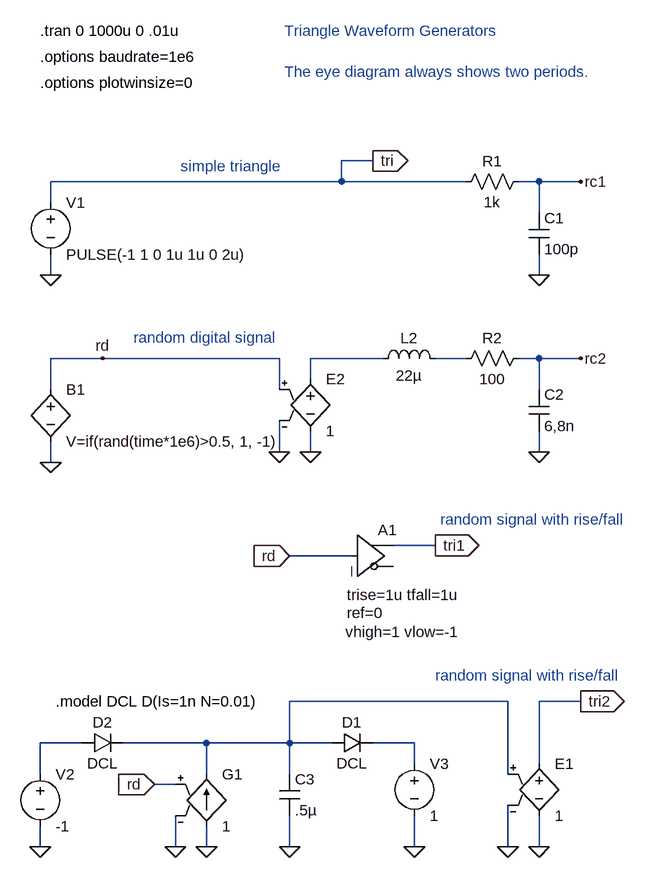
[diagram p0: schematic triangle_eye_diagram.asc]
triangle_eye_diagram.asc, the LTspice schematic file:
Version 4
SHEET 1 880 1220
WIRE -64 144 -112 144
WIRE -112 176 -112 144
WIRE -112 176 -560 176
WIRE 80 176 -112 176
WIRE 192 176 160 176
WIRE 256 176 192 176
WIRE -560 208 -560 176
WIRE 192 224 192 176
WIRE -560 320 -560 288
WIRE 192 320 192 288
WIRE -480 448 -560 448
WIRE -208 448 -480 448
WIRE -48 448 -160 448
WIRE 80 448 32 448
WIRE 192 448 160 448
WIRE 256 448 192 448
WIRE -160 480 -160 448
WIRE -560 496 -560 448
WIRE -208 496 -208 448
WIRE 192 496 192 448
WIRE -208 592 -208 544
WIRE -160 592 -160 560
WIRE 192 592 192 560
WIRE -560 608 -560 576
WIRE 32 736 -32 736
WIRE -96 752 -192 752
WIRE 144 976 -192 976
WIRE 256 976 192 976
WIRE -512 1040 -576 1040
WIRE -320 1040 -448 1040
WIRE -192 1040 -192 976
WIRE -192 1040 -320 1040
WIRE -128 1040 -192 1040
WIRE 0 1040 -64 1040
WIRE 0 1072 0 1040
WIRE 192 1072 192 976
WIRE -576 1088 -576 1040
WIRE -320 1088 -320 1040
WIRE -192 1088 -192 1040
WIRE 144 1088 144 976
WIRE -368 1104 -400 1104
WIRE -576 1200 -576 1168
WIRE -368 1200 -368 1152
WIRE -320 1200 -320 1168
WIRE -192 1200 -192 1152
WIRE 0 1200 0 1152
WIRE 144 1200 144 1136
WIRE 192 1200 192 1152
FLAG 192 320 0
FLAG -560 320 0
FLAG 256 176 rc1
FLAG -64 144 tri
IOPIN -64 144 Out
FLAG -560 608 0
FLAG 192 592 0
FLAG 256 448 rc2
FLAG -480 448 rd
FLAG 32 736 tri1
IOPIN 32 736 Out
FLAG 0 1200 0
FLAG -576 1200 0
FLAG -320 1200 0
FLAG -192 1200 0
FLAG -368 1200 0
FLAG -400 1104 rd
IOPIN -400 1104 In
FLAG 144 1200 0
FLAG 192 1200 0
FLAG 256 976 tri2
IOPIN 256 976 Out
FLAG -192 752 rd
IOPIN -192 752 In
FLAG -160 592 0
FLAG -208 592 0
SYMBOL voltage -560 192 R0
WINDOW 123 0 0 Left 0
WINDOW 39 0 0 Left 0
SYMATTR InstName V1
SYMATTR Value PULSE(-1 1 0 1u 1u 0 2u)
SYMBOL res 64 192 R270
WINDOW 0 32 56 VTop 0
WINDOW 3 0 56 VBottom 0
SYMATTR InstName R1
SYMATTR Value 1k
SYMBOL cap 176 224 R0
SYMATTR InstName C1
SYMATTR Value 100p
SYMBOL bv -560 480 R0
SYMATTR InstName B1
SYMATTR Value V=if(rand(time*1e6)>0.5, 1, -1)
SYMBOL res 64 464 R270
WINDOW 0 32 56 VTop 0
WINDOW 3 0 56 VBottom 0
SYMATTR InstName R2
SYMATTR Value 100
SYMBOL cap 176 496 R0
SYMATTR InstName C2
SYMATTR Value 6,8n
SYMBOL ind -64 464 R270
WINDOW 0 32 56 VTop 0
WINDOW 3 5 56 VBottom 0
SYMATTR InstName L2
SYMATTR Value 22µ
SYMBOL Digital\\buf -96 688 R0
WINDOW 123 -8 152 Left 0
WINDOW 39 -8 124 Left 0
WINDOW 40 -10 181 Left 0
SYMATTR InstName A1
SYMATTR Value2 ref=0
SYMATTR SpiceLine trise=1u tfall=1u
SYMATTR SpiceLine2 vhigh=1 vlow=-1
SYMBOL g -320 1072 R0
SYMATTR InstName G1
SYMATTR Value 1
SYMBOL cap -208 1088 R0
SYMATTR InstName C3
SYMATTR Value .5µ
SYMBOL diode -128 1056 R270
WINDOW 0 32 32 VTop 0
WINDOW 3 0 32 VBottom 0
SYMATTR InstName D1
SYMATTR Value DCL
SYMBOL diode -512 1056 R270
WINDOW 0 32 32 VTop 0
WINDOW 3 0 32 VBottom 0
SYMATTR InstName D2
SYMATTR Value DCL
SYMBOL voltage -576 1072 R0
SYMATTR InstName V2
SYMATTR Value -1
SYMBOL voltage 0 1056 R0
SYMATTR InstName V3
SYMATTR Value 1
SYMBOL e 192 1056 R0
SYMATTR InstName E1
SYMATTR Value 1
SYMBOL e -160 464 R0
SYMATTR InstName E2
SYMATTR Value 1
TEXT -576 -16 Left 0 !.options baudrate=1e6
TEXT -576 -56 Left 0 !.tran 0 1000u 0 .01u
TEXT -576 24 Left 0 !.options plotwinsize=0
TEXT -552 976 Left 0 !.model DCL D(Is=1n N=0.01)
TEXT -432 416 Left 0 ;random digital signal
TEXT -360 152 Left 0 ;simple triangle
TEXT -200 -56 Left 0 ;Triangle Waveform Generators\n \nThe eye diagram always shows two periods.
TEXT 40 696 Left 0 ;random signal with rise/fall
TEXT 32 936 Left 0 ;random signal with rise/fall

The netlist it stands for:
* triangle_eye_diagram.asc
V1 tri 0 PULSE(-1 1 0 1u 1u 0 2u)
R1 tri rc1 1k
C1 rc1 0 100p
B1 rd 0 V=if(rand(time*1e6)>0.5, 1, -1)
R2 N002 rc2 100
C2 rc2 0 6,8n
L2 N001 N002 22µ
A1 rd 0 0 0 0 0 tri1 0 BUF ref=0 trise=1u tfall=1u vhigh=1 vlow=-1
G1 0 N003 rd 0 1
C3 N003 0 .5µ
D1 N003 N005 DCL
D2 N004 N003 DCL
V2 N004 0 -1
V3 N005 0 1
E1 tri2 0 N003 0 1
E2 N001 0 rd 0 1
.model D D
.lib standard.dio
.options baudrate=1e6
.tran 0 1000u 0 .01u
.options plotwinsize=0
.model DCL D(Is=1n N=0.01)
* random digital signal
* simple triangle
* Triangle Waveform Generators
* The eye diagram always shows two periods.
* random signal with rise/fall
* random signal with rise/fall
.backanno
.end